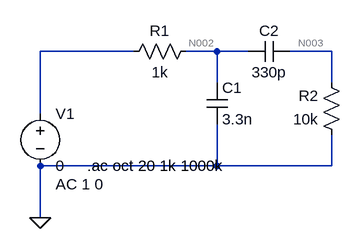
[diagram p0: schematic vezba2.asc]
vezba2.asc, the LTspice schematic file:
Version 4.1
SHEET 1 880 680
WIRE -96 -64 -240 -64
WIRE 32 -64 -16 -64
WIRE 80 -64 32 -64
WIRE 208 -64 144 -64
WIRE 32 -16 32 -64
WIRE 208 -16 208 -64
WIRE -240 32 -240 -64
WIRE 32 112 32 48
WIRE 32 112 -240 112
WIRE 208 112 208 64
WIRE 208 112 32 112
WIRE -240 192 -240 112
FLAG -240 192 0
SYMBOL voltage -240 16 R0
WINDOW 123 24 124 Left 2
WINDOW 39 0 0 Left 0
SYMATTR Value2 AC 1 0
SYMATTR InstName V1
SYMATTR Value 0
SYMBOL res 0 -80 R90
WINDOW 0 0 56 VBottom 2
WINDOW 3 32 56 VTop 2
SYMATTR InstName R1
SYMATTR Value 1k
SYMBOL res 224 80 R180
WINDOW 0 36 76 Left 2
WINDOW 3 36 40 Left 2
SYMATTR InstName R2
SYMATTR Value 10k
SYMBOL cap 16 -16 R0
SYMATTR InstName C1
SYMATTR Value 3.3n
SYMBOL cap 144 -80 R90
WINDOW 0 0 32 VBottom 2
WINDOW 3 32 32 VTop 2
SYMATTR InstName C2
SYMATTR Value 330p
TEXT -168 112 Left 2 !.ac oct 20 1k 1000k

The netlist it stands for:
* vezba2.asc
V1 N001 0 0 AC 1 0
R1 N002 N001 1k
R2 0 N003 10k
C1 N002 0 3.3n
C2 N003 N002 330p
.ac oct 20 1k 1000k
.backanno
.end

* Results of the author's LTspice run, read from the files saved beside the schematic
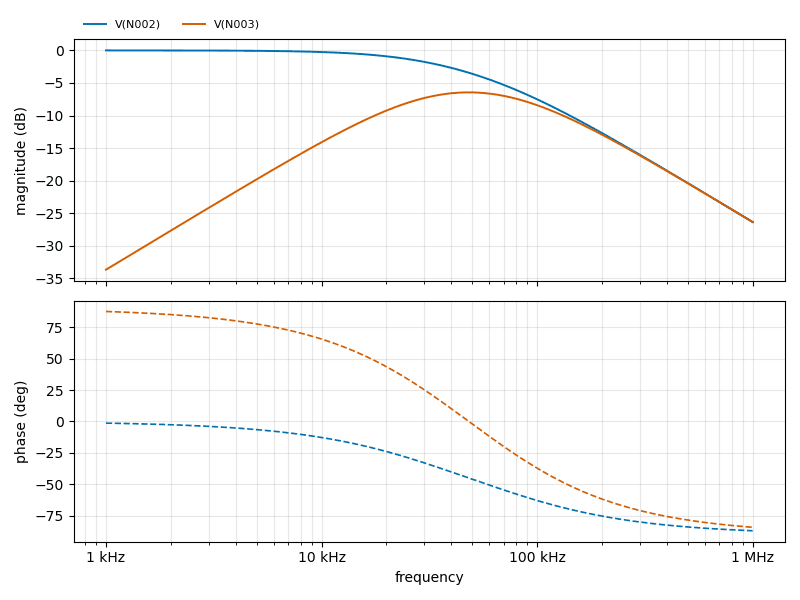
[diagram p1: AC Analysis of vezba2.asc, plotted from the saved traces]
* AC Analysis, 1 run:
*   V(N002): -0.00 dB at 1 kHz, -26.35 dB at 1 MHz, peak -0.00 dB at 1 kHz, 3 dB below the peak at 43.59 kHz
*   V(N003): -33.67 dB at 1 kHz, -26.36 dB at 1 MHz, peak -6.44 dB at 48.5 kHz, 3 dB below the peak at 19.29 kHz and 120.6 kHz